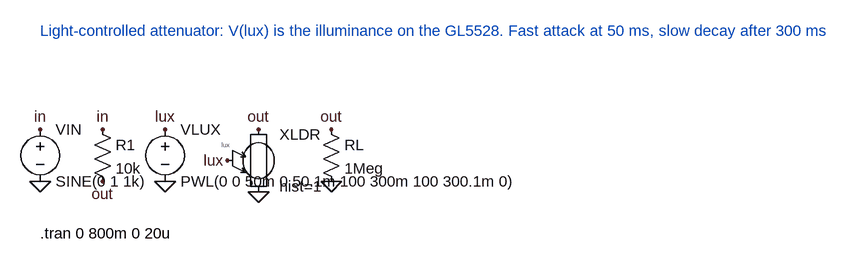
[diagram p0: schematic demo_ldr.asc]
demo_ldr.asc, the LTspice schematic file:
Version 4
SHEET 1 900 400
FLAG 0 112 in
FLAG 0 192 0
FLAG 96 112 in
FLAG 96 192 out
FLAG 336 112 out
FLAG 336 208 0
FLAG 288 160 lux
FLAG 192 112 lux
FLAG 192 192 0
FLAG 448 112 out
FLAG 448 192 0
SYMBOL voltage 0 96 R0
SYMATTR InstName VIN
SYMATTR Value SINE(0 1 1k)
SYMBOL res 80 96 R0
SYMATTR InstName R1
SYMATTR Value 10k
SYMBOL voltage 192 96 R0
SYMATTR InstName VLUX
SYMATTR Value PWL(0 0 50m 0 50.1m 100 300m 100 300.1m 0)
SYMBOL GL5528 320 96 R0
SYMATTR InstName XLDR
SYMBOL res 432 96 R0
SYMATTR InstName RL
SYMATTR Value 1Meg
TEXT 0 272 Left 2 !.tran 0 800m 0 20u
TEXT 0 -40 Left 2 ;Light-controlled attenuator: V(lux) is the illuminance on the GL5528. Fast attack at 50 ms, slow decay after 300 ms

The netlist it stands for:
* demo_ldr.asc
VIN in 0 SINE(0 1 1k)
R1 in out 10k
VLUX lux 0 PWL(0 0 50m 0 50.1m 100 300m 100 300.1m 0)
XXLDR out 0 lux GL5528 hist=1  ; pins A B L
RL out 0 1Meg
.tran 0 800m 0 20u
* Light-controlled attenuator: V(lux) is the illuminance on the GL5528. Fast attack at 50 ms, slow decay after 300 ms
.lib ldr.sub
.backanno
.end